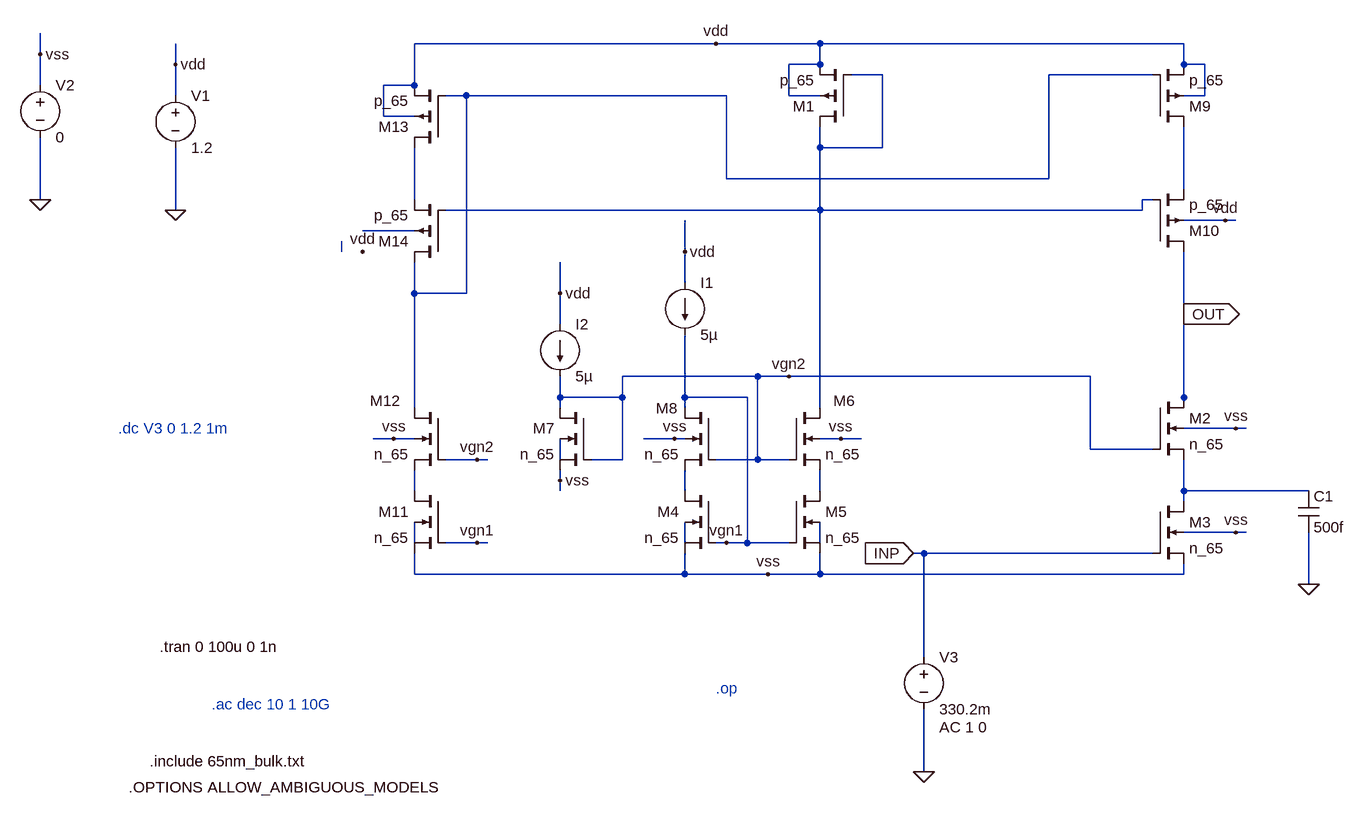
[diagram p0: schematic OTA_SingleEnded_Design.asc]
OTA_SingleEnded_Design.asc, the LTspice schematic file:
Version 4.1
SHEET 1 1248 964
WIRE 272 -240 -192 -240
WIRE 432 -240 272 -240
WIRE 992 -240 432 -240
WIRE -768 -224 -768 -256
WIRE -560 -208 -560 -240
WIRE 432 -208 432 -240
WIRE 432 -208 384 -208
WIRE 992 -208 992 -240
WIRE 1024 -208 992 -208
WIRE 528 -192 480 -192
WIRE 944 -192 784 -192
WIRE -768 -176 -768 -224
WIRE -192 -176 -192 -240
WIRE -192 -176 -240 -176
WIRE -560 -160 -560 -208
WIRE -192 -160 -192 -176
WIRE -112 -160 -144 -160
WIRE 288 -160 -112 -160
WIRE 384 -160 384 -208
WIRE 432 -160 384 -160
WIRE 1024 -160 1024 -208
WIRE 1024 -160 992 -160
WIRE -240 -128 -240 -176
WIRE -192 -128 -240 -128
WIRE 432 -80 432 -112
WIRE 528 -80 528 -192
WIRE 528 -80 432 -80
WIRE 288 -32 288 -160
WIRE 784 -32 784 -192
WIRE 784 -32 288 -32
WIRE 992 -16 992 -112
WIRE -768 0 -768 -96
WIRE -192 0 -192 -80
WIRE 944 0 928 0
WIRE -560 16 -560 -80
WIRE 432 16 432 -80
WIRE 432 16 -144 16
WIRE 928 16 928 0
WIRE 928 16 432 16
WIRE 1056 32 992 32
WIRE 1072 32 1056 32
WIRE -192 48 -272 48
WIRE -304 80 -304 64
WIRE 224 80 224 32
WIRE 224 128 224 80
WIRE -192 144 -192 96
WIRE -112 144 -112 -160
WIRE -112 144 -192 144
WIRE 32 144 32 96
WIRE 992 176 992 80
WIRE 32 192 32 144
WIRE 336 272 128 272
WIRE 384 272 336 272
WIRE 848 272 384 272
WIRE 32 304 32 272
WIRE 128 304 128 272
WIRE 128 304 32 304
WIRE 224 304 224 208
WIRE 320 304 224 304
WIRE 992 304 992 176
WIRE -192 320 -192 144
WIRE 32 320 32 304
WIRE 224 320 224 304
WIRE 432 320 432 16
WIRE 992 320 992 304
WIRE 1072 352 992 352
WIRE 1088 352 1072 352
WIRE -224 368 -256 368
WIRE -192 368 -224 368
WIRE 208 368 160 368
WIRE 224 368 208 368
WIRE 464 368 432 368
WIRE 496 368 464 368
WIRE 848 384 848 272
WIRE 944 384 848 384
WIRE -96 400 -144 400
WIRE -80 400 -96 400
WIRE 32 400 32 368
WIRE 128 400 128 304
WIRE 128 400 80 400
WIRE 336 400 336 272
WIRE 336 400 272 400
WIRE 384 400 336 400
WIRE 32 432 32 416
WIRE -192 448 -192 416
WIRE 32 448 32 432
WIRE 224 448 224 416
WIRE 432 448 432 416
WIRE 992 448 992 400
WIRE 1184 448 992 448
WIRE 992 464 992 448
WIRE 1072 512 992 512
WIRE 1088 512 1072 512
WIRE -192 528 -192 496
WIRE -96 528 -144 528
WIRE -80 528 -96 528
WIRE 224 528 224 496
WIRE 288 528 272 528
WIRE 320 528 320 304
WIRE 320 528 288 528
WIRE 384 528 320 528
WIRE 432 528 432 496
WIRE 592 544 576 544
WIRE 944 544 592 544
WIRE -192 576 -192 544
WIRE 224 576 224 544
WIRE 224 576 -192 576
WIRE 352 576 224 576
WIRE 432 576 432 544
WIRE 432 576 352 576
WIRE 992 576 992 560
WIRE 992 576 432 576
WIRE 1184 592 1184 512
WIRE 592 704 592 544
WIRE 592 880 592 784
FLAG 224 80 vdd
FLAG 1072 352 vss
FLAG 1072 512 vss
FLAG 464 368 vss
FLAG 352 576 vss
FLAG 32 144 vdd
FLAG 32 432 vss
FLAG 208 368 vss
FLAG 1056 32 vdd
FLAG -224 368 vss
FLAG -96 528 vgn1
FLAG -96 400 vgn2
FLAG -272 80 vdd
FLAG 272 -240 vdd
FLAG -560 16 0
FLAG -560 -208 vdd
FLAG -768 0 0
FLAG -768 -224 vss
FLAG 576 544 INP
IOPIN 576 544 In
FLAG 992 176 OUT
IOPIN 992 176 Out
FLAG 288 528 vgn1
FLAG 384 272 vgn2
FLAG 592 880 0
FLAG 1184 592 0
DATAFLAG 848 544 ""
DATAFLAG 784 272 ""
DATAFLAG 992 128 ""
DATAFLAG 752 -32 ""
DATAFLAG 640 16 ""
DATAFLAG 992 432 ""
SYMBOL pmos4 480 -112 R180
SYMATTR InstName M1
SYMATTR Value p_65
SYMATTR Value2 l=200n w=2.5u
SYMBOL nmos4 944 304 R0
SYMATTR InstName M2
SYMATTR Value n_65
SYMATTR Value2 l=300n w=10u
SYMBOL nmos4 944 464 R0
SYMATTR InstName M3
SYMATTR Value n_65
SYMATTR Value2 l=300n w=10u
SYMBOL nmos4 272 448 M0
SYMATTR InstName M4
SYMATTR Value n_65
SYMATTR Value2 l=300n w=10u
SYMBOL current 224 128 R0
WINDOW 123 0 0 Left 0
WINDOW 39 0 0 Left 0
SYMATTR InstName I1
SYMATTR Value 5µ
SYMBOL nmos4 384 448 R0
SYMATTR InstName M5
SYMATTR Value n_65
SYMATTR Value2 l=300n w=10u
SYMBOL nmos4 384 320 R0
WINDOW 0 69 -11 Left 2
SYMATTR InstName M6
SYMATTR Value n_65
SYMATTR Value2 l=300n w=10u
SYMBOL nmos4 80 320 M0
SYMATTR InstName M7
SYMATTR Value n_65
SYMATTR Value2 l=300n w=2.5u
SYMBOL current 32 192 R0
WINDOW 123 0 0 Left 0
WINDOW 39 0 0 Left 0
SYMATTR InstName I2
SYMATTR Value 5µ
SYMBOL nmos4 272 320 M0
WINDOW 0 59 1 Left 2
SYMATTR InstName M8
SYMATTR Value n_65
SYMATTR Value2 l=300n w=10u
SYMBOL pmos4 944 -112 M180
SYMATTR InstName M9
SYMATTR Value p_65
SYMATTR Value2 l=200n w=10u
SYMBOL pmos4 944 80 M180
SYMATTR InstName M10
SYMATTR Value p_65
SYMATTR Value2 l=200n w=10u
SYMBOL nmos4 -144 448 M0
SYMATTR InstName M11
SYMATTR Value n_65
SYMATTR Value2 l=300n w=10u
SYMBOL nmos4 -144 320 M0
WINDOW 0 69 -11 Left 2
SYMATTR InstName M12
SYMATTR Value n_65
SYMATTR Value2 l=300n w=10u
SYMBOL pmos4 -144 -80 R180
SYMATTR InstName M13
SYMATTR Value p_65
SYMATTR Value2 l=200n w=10u
SYMBOL pmos4 -144 96 R180
SYMATTR InstName M14
SYMATTR Value p_65
SYMATTR Value2 l=200n w=10u
SYMBOL voltage -560 -176 R0
WINDOW 123 0 0 Left 0
WINDOW 39 0 0 Left 0
SYMATTR InstName V1
SYMATTR Value 1.2
SYMBOL voltage -768 -192 R0
WINDOW 123 0 0 Left 0
WINDOW 39 0 0 Left 0
SYMATTR InstName V2
SYMATTR Value 0
SYMBOL voltage 592 688 R0
WINDOW 123 24 124 Left 2
WINDOW 39 0 0 Left 0
SYMATTR Value2 AC 1 0
SYMATTR InstName V3
SYMATTR Value 330.2m
SYMBOL cap 1168 448 R0
SYMATTR InstName C1
SYMATTR Value 500f
TEXT -648 352 Left 2 ;.dc V3 0 1.2 1m
TEXT -600 864 Left 2 !.include 65nm_bulk.txt
TEXT -632 904 Left 2 !.OPTIONS ALLOW_AMBIGUOUS_MODELS
TEXT 272 752 Left 2 ;.op
TEXT -504 776 Left 2 ;.ac dec 10 1 10G
TEXT -584 688 Left 2 !.tran 0 100u 0 1n

The netlist it stands for:
* OTA_SingleEnded_Design.asc
M1 N001 N001 vdd vdd p_65 l=200n w=2.5u
M2 OUT vgn2 N011 vss n_65 l=300n w=10u
M3 N011 INP vss vss n_65 l=300n w=10u
M4 N009 vgn1 vss N013 n_65 l=300n w=10u
I1 vdd vgn1 5µ
M5 N010 vgn1 vss N014 n_65 l=300n w=10u
M6 N001 vgn2 N010 vss n_65 l=300n w=10u
M7 vgn2 vgn2 vss N007 n_65 l=300n w=2.5u
I2 vdd vgn2 5µ
M8 vgn1 vgn2 N009 vss n_65 l=300n w=10u
M9 N003 N002 vdd vdd p_65 l=200n w=10u
M10 OUT N001 N003 vdd p_65 l=200n w=10u
M11 N008 vgn1 vss N012 n_65 l=300n w=10u
M12 N002 vgn2 N008 vss n_65 l=300n w=10u
M13 N004 N002 vdd vdd p_65 l=200n w=10u
M14 N002 N001 N004 N005 p_65 l=200n w=10u
V1 vdd 0 1.2
V2 vss 0 0
V3 INP 0 330.2m AC 1 0
C1 N011 0 500f
.model NMOS NMOS
.model PMOS PMOS
.lib standard.mos
* .dc V3 0 1.2 1m
.include 65nm_bulk.txt
.OPTIONS ALLOW_AMBIGUOUS_MODELS
* .op
* .ac dec 10 1 10G
.tran 0 100u 0 1n
.backanno
.end